# Altium project FIT_PM12_v1.1.PrjPcb (part 6 of 13)

## Sheet FPGA_H.SchDoc: FIT_PM12 board
size 420 x 297 mm; CheckedBy: G.Kasprowicz; Author: INR Moscow; CompanyName: WUT ISE; DrawnBy: M.Podgórski; Organization: WUT ISE; Address1: PW ISE; Address2: Nowowiejska 15/19 00-665 Warsaw; Address3: gkasprow@gmail.com; DocumentNumber: 29; Revision: 2; SheetNumber: 27; SheetTotal: 34; ModifiedBy: -; CheckedDate: -; Title2: FPGA H TDC1; DivGrp: WUT ISE; Designer: INR RAS; ModifiedDate: -; ProjectName: Sensor Box
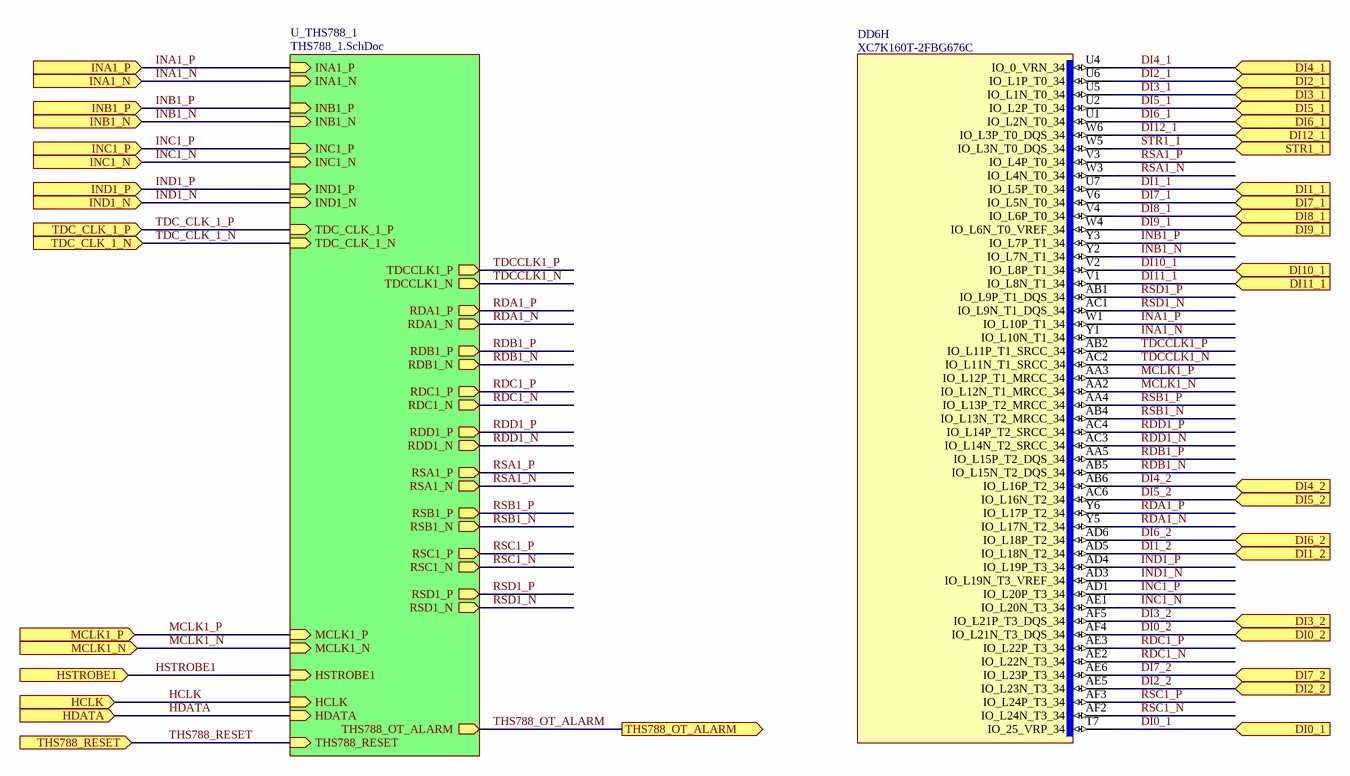
[diagram p15: FPGA_H.SchDoc]

### Parts
DD6  XC7K160T-2FBG676C  [BGA676C100P26X26_2700X2700X254]  (part H of 15)

### Sub-sheets
U_THS788_1 = THS788_1.SchDoc: INC1_P (in), INC1_N (in), IND1_N (in), IND1_P (in), RDD1_P (out), RDD1_N (out), RSD1_P (out), RSD1_N (out), HDATA (in), HCLK (in), HSTROBE1 (in), TDCCLK1_P (out), TDCCLK1_N (out), RSB1_P (out), RSB1_N (out), RDB1_P (out), RDB1_N (out), THS788_OT_ALARM (out), THS788_RESET (in), MCLK1_N (in), MCLK1_P (in), INB1_N (in), INB1_P (in), TDC_CLK_1_P (in), TDC_CLK_1_N (in), INA1_P (in), INA1_N (in), RDA1_N (out), RDA1_P (out), RSA1_P (out), RSA1_N (out), RSC1_N (out), RSC1_P (out), RDC1_N (out), RDC1_P (out)

### Ports
DI0_1 (in), DI0_2 (in), DI1_1 (in), DI1_2 (in), DI2_1 (in), DI2_2 (in), DI3_1 (in), DI3_2 (in), DI4_1 (in), DI4_2 (in), DI5_1 (in), DI5_2 (in), DI6_1 (in), DI6_2 (in), DI7_1 (in), DI7_2 (in), DI8_1 (in), DI9_1 (in), DI10_1 (in), DI11_1 (in), DI12_1 (in), HCLK (in), HDATA (in), HSTROBE1 (in), INA1_N (in), INA1_P (in), INB1_N (in), INB1_P (in), INC1_N (in), INC1_P (in), IND1_N (in), IND1_P (in), MCLK1_N (in), MCLK1_P (in), STR1_1 (in), TDC_CLK_1_N (in), TDC_CLK_1_P (in), THS788_OT_ALARM (out), THS788_RESET (in)

### Nets
DI0_1: DD6.T7(IO_25_VRP_34) ; port DI0_1  [project net DI0_]
DI0_2: DD6.AF4(IO_L21N_T3_DQS_34) ; port DI0_2  [project net DI0_]
DI1_1: DD6.U7(IO_L5P_T0_34) ; port DI1_1  [project net DI1_]
DI1_2: DD6.AD5(IO_L18N_T2_34) ; port DI1_2  [project net DI1_]
DI2_1: DD6.U6(IO_L1P_T0_34) ; port DI2_1  [project net DI2_]
DI2_2: DD6.AE5(IO_L23N_T3_34) ; port DI2_2  [project net DI2_]
DI3_1: DD6.U5(IO_L1N_T0_34) ; port DI3_1  [project net DI3_]
DI3_2: DD6.AF5(IO_L21P_T3_DQS_34) ; port DI3_2  [project net DI3_]
DI4_1: DD6.U4(IO_0_VRN_34) ; port DI4_1  [project net DI4_]
DI4_2: DD6.AB6(IO_L16P_T2_34) ; port DI4_2  [project net DI4_]
DI5_1: DD6.U2(IO_L2P_T0_34) ; port DI5_1  [project net DI5_]
DI5_2: DD6.AC6(IO_L16N_T2_34) ; port DI5_2  [project net DI5_]
DI6_1: DD6.U1(IO_L2N_T0_34) ; port DI6_1  [project net DI6_]
DI6_2: DD6.AD6(IO_L18P_T2_34) ; port DI6_2  [project net DI6_]
DI7_1: DD6.V6(IO_L5N_T0_34) ; port DI7_1  [project net DI7_]
DI7_2: DD6.AE6(IO_L23P_T3_34) ; port DI7_2  [project net DI7_]
DI8_1: DD6.V4(IO_L6P_T0_34) ; port DI8_1  [project net DI8_]
DI9_1: DD6.W4(IO_L6N_T0_VREF_34) ; port DI9_1  [project net DI9_]
DI10_1: DD6.V2(IO_L8P_T1_34) ; port DI10_1  [project net DI10_]
DI11_1: DD6.V1(IO_L8N_T1_34) ; port DI11_1  [project net DI11_]
DI12_1: DD6.W6(IO_L3P_T0_DQS_34) ; port DI12_1  [project net DI12_]
HCLK: port HCLK, sheet U_THS788_1/HCLK
HDATA: port HDATA, sheet U_THS788_1/HDATA
HSTROBE1: port HSTROBE1, sheet U_THS788_1/HSTROBE1
INA1_N: DD6.Y1(IO_L10N_T1_34) ; port INA1_N, sheet U_THS788_1/INA1_N  [project net Event_N]
INA1_P: DD6.W1(IO_L10P_T1_34) ; port INA1_P, sheet U_THS788_1/INA1_P  [project net Event_P]
INB1_N: DD6.Y2(IO_L7N_T1_34) ; port INB1_N, sheet U_THS788_1/INB1_N  [project net Event_N]
INB1_P: DD6.Y3(IO_L7P_T1_34) ; port INB1_P, sheet U_THS788_1/INB1_P  [project net Event_P]
INC1_N: DD6.AE1(IO_L20N_T3_34) ; port INC1_N, sheet U_THS788_1/INC1_N  [project net Event_N]
INC1_P: DD6.AD1(IO_L20P_T3_34) ; port INC1_P, sheet U_THS788_1/INC1_P  [project net Event_P]
IND1_N: DD6.AD3(IO_L19N_T3_VREF_34) ; port IND1_N, sheet U_THS788_1/IND1_N  [project net Event_N]
IND1_P: DD6.AD4(IO_L19P_T3_34) ; port IND1_P, sheet U_THS788_1/IND1_P  [project net Event_P]
MCLK1_N: DD6.AA2(IO_L12N_T1_MRCC_34) ; port MCLK1_N, sheet U_THS788_1/MCLK1_N
MCLK1_P: DD6.AA3(IO_L12P_T1_MRCC_34) ; port MCLK1_P, sheet U_THS788_1/MCLK1_P
RDA1_N: DD6.Y5(IO_L17N_T2_34) ; sheet U_THS788_1/RDA1_N
RDA1_P: DD6.Y6(IO_L17P_T2_34) ; sheet U_THS788_1/RDA1_P
RDB1_N: DD6.AB5(IO_L15N_T2_DQS_34) ; sheet U_THS788_1/RDB1_N
RDB1_P: DD6.AA5(IO_L15P_T2_DQS_34) ; sheet U_THS788_1/RDB1_P
RDC1_N: DD6.AE2(IO_L22N_T3_34) ; sheet U_THS788_1/RDC1_N
RDC1_P: DD6.AE3(IO_L22P_T3_34) ; sheet U_THS788_1/RDC1_P
RDD1_N: DD6.AC3(IO_L14N_T2_SRCC_34) ; sheet U_THS788_1/RDD1_N
RDD1_P: DD6.AC4(IO_L14P_T2_SRCC_34) ; sheet U_THS788_1/RDD1_P
RSA1_N: DD6.W3(IO_L4N_T0_34) ; sheet U_THS788_1/RSA1_N
RSA1_P: DD6.V3(IO_L4P_T0_34) ; sheet U_THS788_1/RSA1_P
RSB1_N: DD6.AB4(IO_L13N_T2_MRCC_34) ; sheet U_THS788_1/RSB1_N
RSB1_P: DD6.AA4(IO_L13P_T2_MRCC_34) ; sheet U_THS788_1/RSB1_P
RSC1_N: DD6.AF2(IO_L24N_T3_34) ; sheet U_THS788_1/RSC1_N
RSC1_P: DD6.AF3(IO_L24P_T3_34) ; sheet U_THS788_1/RSC1_P
RSD1_N: DD6.AC1(IO_L9N_T1_DQS_34) ; sheet U_THS788_1/RSD1_N
RSD1_P: DD6.AB1(IO_L9P_T1_DQS_34) ; sheet U_THS788_1/RSD1_P
STR1_1: DD6.W5(IO_L3N_T0_DQS_34) ; port STR1_1  [project net STR1_]
TDC_CLK_1_N: port TDC_CLK_1_N, sheet U_THS788_1/TDC_CLK_1_N
TDC_CLK_1_P: port TDC_CLK_1_P, sheet U_THS788_1/TDC_CLK_1_P
TDCCLK1_N: DD6.AC2(IO_L11N_T1_SRCC_34) ; sheet U_THS788_1/TDCCLK1_N
TDCCLK1_P: DD6.AB2(IO_L11P_T1_SRCC_34) ; sheet U_THS788_1/TDCCLK1_P
THS788_OT_ALARM: port THS788_OT_ALARM, sheet U_THS788_1/THS788_OT_ALARM
THS788_RESET: port THS788_RESET, sheet U_THS788_1/THS788_RESET

### Notes on the sheet
- Project/Equipment
- Document
- Designer
- Drawn by
- Check.by
- Copyright WUT ISE 2024.
  This documentation describes Open Hardware and is licensed under the CERN OHL v.2. You may redistribute and modify this documentation under the terms of the CERN OHL v.2. (http://ohwr.org/CERNOHL). This documentation is distributed WITHOUT ANY EXPRESS OR IMPLIED WARRANTY, INCLUDING OF MERCHANTABILITY, SATISFACTORY QUALITY AND FITNESS FOR A PARTICULAR PURPOSE. Please see the CERN OHL v.2 for applicable conditions.
- Contact
- File
- Last Mod.
- Print Date
- Sheet
- Size
- A3
- of
- Rev

### Library data of the parts
DD6 = XC7K160T-2FBG676C: KINTEX-7, FPGA, 676-Ball BGA, Pb-Free; Part Description: KINTEX-7 FPGA, 162240 Logic Cells, 400 User I/O, 8 GTXs, 676-Ball BGA, Speed Grade 2, Commercial Grade, Pb-Free; Manufacturer: XILINX; PressFit: No; Bonding: No; Part Number: XC7K160T-2FBG676C; Component Kind: Standard; Component Type: Standard; Device: XC7K160T-2FBG676C; PackageDescription: BGA, 1.00mm Pitch, Square; 676 Pin, 26 Columns X 26 Rows, Body 27.0mm X 27.0mm X 2.54mm H, IPC Medium Density; Manufacturer Part Number: XC7K160T-2FBG676C; Pin Count: 676; Case: BGA676; Mounted: Yes; Socket: No; SMD: Yes; Sense: No; ComponentHeight: 2.54mm; HelpURL: \\cern.ch\dfs\Applications\Altium\Datasheets\XC7K160T-xFBG676C.pdf; ComponentLink1URL: \\cern.ch\dfs\Applications\Altium\Datasheets\XC7K160T-xFBG676C_Package-Pinout.pdf; ComponentLink1Description: Package/Pinout; Author: CERN DEM BC; CreateDate: 06.02.2020; LatestRevisionDate: 06.02.2020

## Sheet THS788_1.SchDoc: FIT_PM12 board
size 420 x 297 mm; CheckedBy: G.Kasprowicz; Author: INR Moscow; CompanyName: WUT ISE; DrawnBy: M.Podgórski; Organization: WUT ISE; Address1: PW ISE; Address2: Nowowiejska 15/19 00-665 Warsaw; Address3: gkasprow@gmail.com; DocumentNumber: 22; Revision: 2; SheetNumber: 28; SheetTotal: 34; ModifiedBy: -; CheckedDate: -; Title2: TDC1; DivGrp: WUT ISE; Designer: INR RAS; ModifiedDate: -; ProjectName: Sensor Box
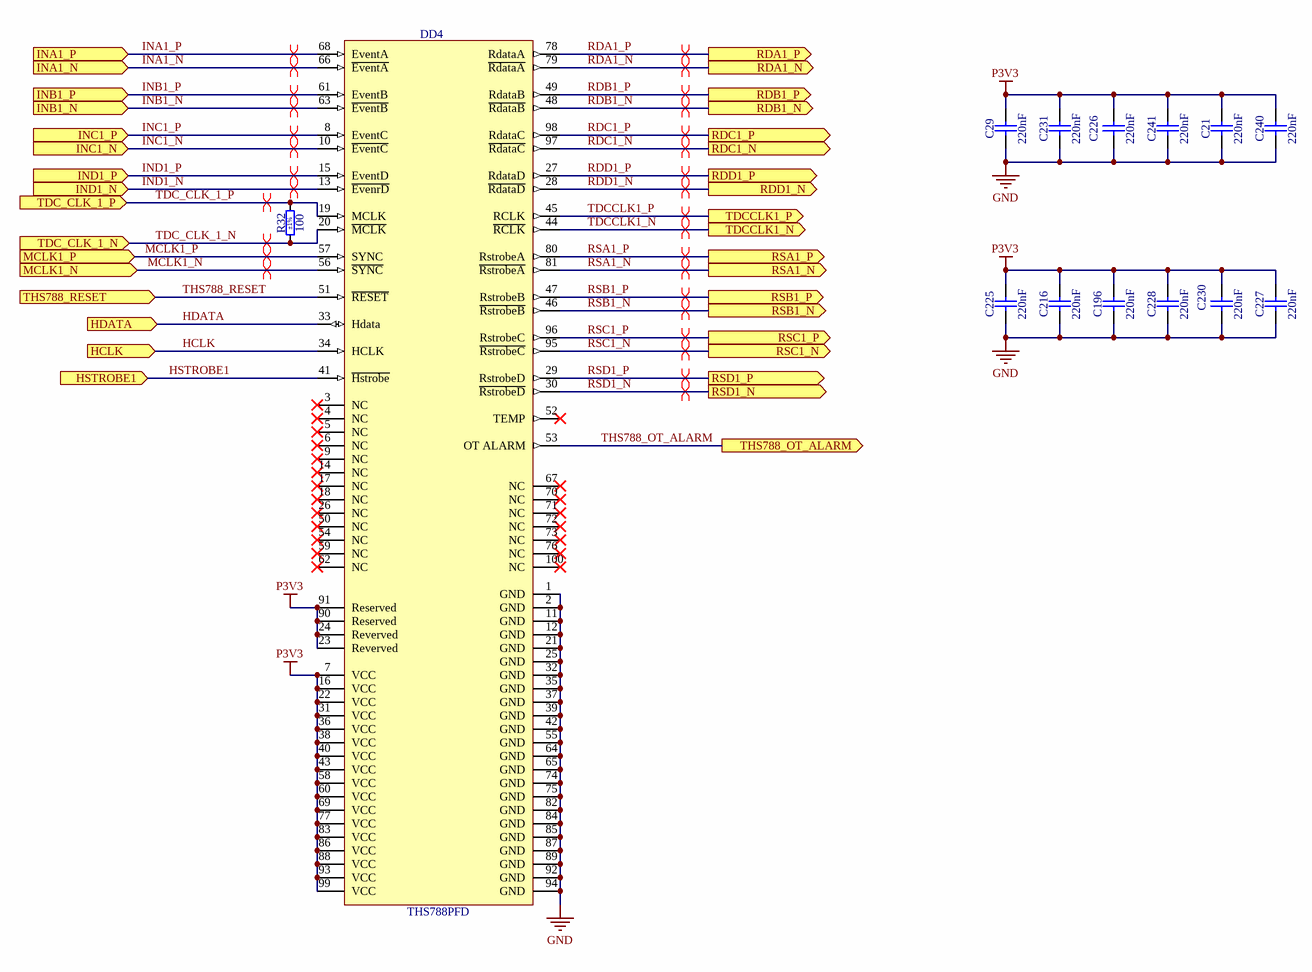
[diagram p16: THS788_1.SchDoc]

### Parts
C21  220nF  [CAPC2012X135N]
C29  220nF  [CAPC2012X135N]
C196  220nF  [CAPC2012X135N]
C216  220nF  [CAPC2012X135N]
C225  220nF  [CAPC2012X135N]
C226  220nF  [CAPC2012X135N]
C227  220nF  [CAPC2012X135N]
C228  220nF  [CAPC2012X135N]
C230  220nF  [CAPC2012X135N]
C231  220nF  [CAPC2012X135N]
C240  220nF  [CAPC2012X135N]
C241  220nF  [CAPC2012X135N]
DD4  THS788PFD  [TEXAS_PFD (S-PQFP-G100)]
R32  100  Tolerance: ±1%  [RESC1608X55N]

### Ports
HCLK (in), HDATA (in), HSTROBE1 (in), INA1_N (in), INA1_P (in), INB1_N (in), INB1_P (in), INC1_N (in), INC1_P (in), IND1_N (in), IND1_P (in), MCLK1_N (in), MCLK1_P (in), RDA1_N (out), RDA1_P (out), RDB1_N (out), RDB1_P (out), RDC1_N (out), RDC1_P (out), RDD1_N (out), RDD1_P (out), RSA1_N (out), RSA1_P (out), RSB1_N (out), RSB1_P (out), RSC1_N (out), RSC1_P (out), RSD1_N (out), RSD1_P (out), TDC_CLK_1_N (in), TDC_CLK_1_P (in), TDCCLK1_N (out), TDCCLK1_P (out), THS788_OT_ALARM (out), THS788_RESET (in)

### Nets
GND: C21.1 C29.1 C196.1 C216.1 C225.1 C226.1 C227.1 C228.1 C230.1 C231.1 C240.1 C241.1 DD4.1(GND) DD4.2(GND) DD4.11(GND) DD4.12(GND) DD4.21(GND) DD4.25(GND) DD4.32(GND) DD4.35(GND) DD4.37(GND) DD4.39(GND) DD4.42(GND) DD4.55(GND) DD4.64(GND) DD4.65(GND) DD4.74(GND) DD4.75(GND) DD4.82(GND) DD4.84(GND) DD4.85(GND) DD4.87(GND) DD4.89(GND) DD4.92(GND) DD4.94(GND)
P3V3: C21.2 C29.2 C196.2 C216.2 C225.2 C226.2 C227.2 C228.2 C230.2 C231.2 C240.2 C241.2 DD4.7(VCC) DD4.16(VCC) DD4.22(VCC) DD4.23(Reverved) DD4.24(Reverved) DD4.31(VCC) DD4.36(VCC) DD4.38(VCC) DD4.40(VCC) DD4.43(VCC) DD4.58(VCC) DD4.60(VCC) DD4.69(VCC) DD4.77(VCC) DD4.83(VCC) DD4.86(VCC) DD4.88(VCC) DD4.90(Reserved) DD4.91(Reserved) DD4.93(VCC) DD4.99(VCC)
HCLK: DD4.34(HCLK) ; port HCLK
HDATA: DD4.33(Hdata) ; port HDATA
HSTROBE1: DD4.41(~{Hstrobe}) ; port HSTROBE1
INA1_N: DD4.66(~{EventA}) ; port INA1_N  [project net Event_N]
INA1_P: DD4.68(EventA) ; port INA1_P  [project net Event_P]
INB1_N: DD4.63(~{EventB}) ; port INB1_N  [project net Event_N]
INB1_P: DD4.61(EventB) ; port INB1_P  [project net Event_P]
INC1_N: DD4.10(~{EventC}) ; port INC1_N  [project net Event_N]
INC1_P: DD4.8(EventC) ; port INC1_P  [project net Event_P]
IND1_N: DD4.13(~{EvenrD}) ; port IND1_N  [project net Event_N]
IND1_P: DD4.15(EventD) ; port IND1_P  [project net Event_P]
MCLK1_N: DD4.56(~{SYNC}) ; port MCLK1_N
MCLK1_P: DD4.57(SYNC) ; port MCLK1_P
RDA1_N: DD4.79(~{RdataA}) ; port RDA1_N
RDA1_P: DD4.78(RdataA) ; port RDA1_P
RDB1_N: DD4.48(~{RdataB}) ; port RDB1_N
RDB1_P: DD4.49(RdataB) ; port RDB1_P
RDC1_N: DD4.97(~{RdataC}) ; port RDC1_N
RDC1_P: DD4.98(RdataC) ; port RDC1_P
RDD1_N: DD4.28(~{RdataD}) ; port RDD1_N
RDD1_P: DD4.27(RdataD) ; port RDD1_P
RSA1_N: DD4.81(~{RstrobeA}) ; port RSA1_N
RSA1_P: DD4.80(RstrobeA) ; port RSA1_P
RSB1_N: DD4.46(~{RstrobeB}) ; port RSB1_N
RSB1_P: DD4.47(RstrobeB) ; port RSB1_P
RSC1_N: DD4.95(~{RstrobeC}) ; port RSC1_N
RSC1_P: DD4.96(RstrobeC) ; port RSC1_P
RSD1_N: DD4.30(~{RstrobeD}) ; port RSD1_N
RSD1_P: DD4.29(RstrobeD) ; port RSD1_P
TDC_CLK_1_N: DD4.20(~{MCLK}) R32.1 ; port TDC_CLK_1_N
TDC_CLK_1_P: DD4.19(MCLK) R32.2 ; port TDC_CLK_1_P
TDCCLK1_N: DD4.44(~{RCLK}) ; port TDCCLK1_N
TDCCLK1_P: DD4.45(RCLK) ; port TDCCLK1_P
THS788_OT_ALARM: DD4.53(OT_ALARM) ; port THS788_OT_ALARM
THS788_RESET: DD4.51(~{RESET}) ; port THS788_RESET

Not connected (* = marked no-connect by the designer): DD4 3(NC)* 4(NC)* 5(NC)* 6(NC)* 9(NC)* 14(NC)* 17(NC)* 18(NC)* 26(NC)* 50(NC)* 52(TEMP)* 54(NC)* 59(NC)* 62(NC)* 67(NC)* 70(NC)* 71(NC)* 72(NC)* 73(NC)* 76(NC)* 100(NC)*

### Layout directives
differential pair: Event_N, Event_P, MCLK1_N, MCLK1_P, RDA1_N, RDA1_P, RDB1_N, RDB1_P, RDC1_N, RDC1_P, RDD1_N, RDD1_P, RSA1_N, RSA1_P, RSB1_N, RSB1_P, RSC1_N, RSC1_P, RSD1_N, RSD1_P, TDC_CLK_1_N, TDC_CLK_1_P, TDCCLK1_N, TDCCLK1_P

### Notes on the sheet
- Project/Equipment
- Document
- Designer
- Drawn by
- Check.by
- Copyright WUT ISE 2024.
  This documentation describes Open Hardware and is licensed under the CERN OHL v.2. You may redistribute and modify this documentation under the terms of the CERN OHL v.2. (http://ohwr.org/CERNOHL). This documentation is distributed WITHOUT ANY EXPRESS OR IMPLIED WARRANTY, INCLUDING OF MERCHANTABILITY, SATISFACTORY QUALITY AND FITNESS FOR A PARTICULAR PURPOSE. Please see the CERN OHL v.2 for applicable conditions.
- Contact
- File
- Last Mod.
- Print Date
- Sheet
- Size
- A3
- of
- Rev

### Library data of the parts
C21 C29 C196 C216 C225-C228 C230 C231 C240 C241 = CC0805_220NF_50V_10%_X7R: Non-polarised capacitor; Part Description: SMD Multilayer Chip Ceramic Capacitor; Manufacturer: GENERIC; Manufacturer1 Part Number: GRM21BR71H224KA01L; Voltage: 50V; TC: X7R; Tolerance: ±10%; Part Number: CC0805_220NF_50V_10%_X7R; Component Kind: Standard; Component Type: Standard; Pin Count: 2; Value: 220nF; Status: Preferred; Manufacturer Part Number: CC0805_220NF_50V_10%_X7R; Case: 0805; Mounted: Yes; Socket: No; SMD: Yes; Sense: No; Manufacturer1 Example: MURATA; Manufacturer1 ComponentHeight: 1.35mm; HelpURL: \\cern.ch\dfs\Applications\Altium\Datasheets\CC0805_X7R_MURATA.pdf; Author: CERN DEM JLC; CreateDate: 03.12.2007; LatestRevisionDate: 03.12.2007
DD4 = THS788PFD: Quad-Channel Time Measurement Unit (TMU); Manufacturer: TEXAS INSTRUMENTS; PressFit: No; Bonding: No; Part Number: THS788PFD; Component Kind: Standard; Component Type: Standard; Device: THS788PFD; Footprint: TEXAS_1PFD (S-PQFP-G100); PackageDescription: QFP, 0.50mm Pitch, Square; 100 Pin, 14.0mm L X 14.0mm W X 1.20mm H body (w/Thermal Tab 6.0 X 6.0mm), IPC Medium Density; Status: Not Recommended; Part Description: Quad-Channel Time Measurement Unit (TMU); Manufacturer Part Number: THS788PFD; Pin Count: 101; Case: QFP100; Mounted: Yes; Socket: No; SMD: Yes; Sense: No; ComponentHeight: 1.2mm; Author: CERN DEM HF; HelpURL: \\cern.ch\dfs\Applications\Altium\Datasheets\THS788.pdf; CreateDate: 10.06.2024; LatestRevisionDate: 10.06.2024
R32 = R0603_100R_1%_0.1W_100PPM: Resistor - 1%; Part Description: General Purpose Thick Film Chip Resistor; Manufacturer: GENERIC; Manufacturer1 Part Number: NRC06F4700TRF; Power: 0.1W; TC: ±100ppm/°C; PressFit: No; Part Number: R0603_100R_1%_0.1W_100PPM; Component Kind: Standard; Component Type: Standard; Pin Count: 2; Value: 100; Status: Preferred; Manufacturer Part Number: R0603_100R_1%_0.1W_100PPM; Case: 0603; Mounted: Yes; Sense: No; Socket: No; SMD: Yes; Manufacturer1 Example: NIC COMPONENT; Manufacturer1 ComponentHeight: 0.55mm; HelpURL: \\cern.ch\dfs\Applications\Altium\Datasheets\R0603_1NIC_1NRC.pdf; Author: CERN DEM JLC; CreateDate: 03.12.2007; LatestRevisionDate: 13.03.2008

## Sheet FPGA_D_F.SchDoc: FIT_PM12 board
size 420 x 297 mm; CheckedBy: G.Kasprowicz; Author: INR Moscow; CompanyName: WUT ISE; DrawnBy: M.Podgórski; Organization: WUT ISE; Address1: PW ISE; Address2: Nowowiejska 15/19 00-665 Warsaw; Address3: gkasprow@gmail.com; DocumentNumber: 31; Revision: 2; SheetNumber: 30; SheetTotal: 34; ModifiedBy: -; CheckedDate: -; Title2: FPGA D F TDC3; DivGrp: WUT ISE; Designer: INR RAS; ModifiedDate: -; ProjectName: Sensor Box
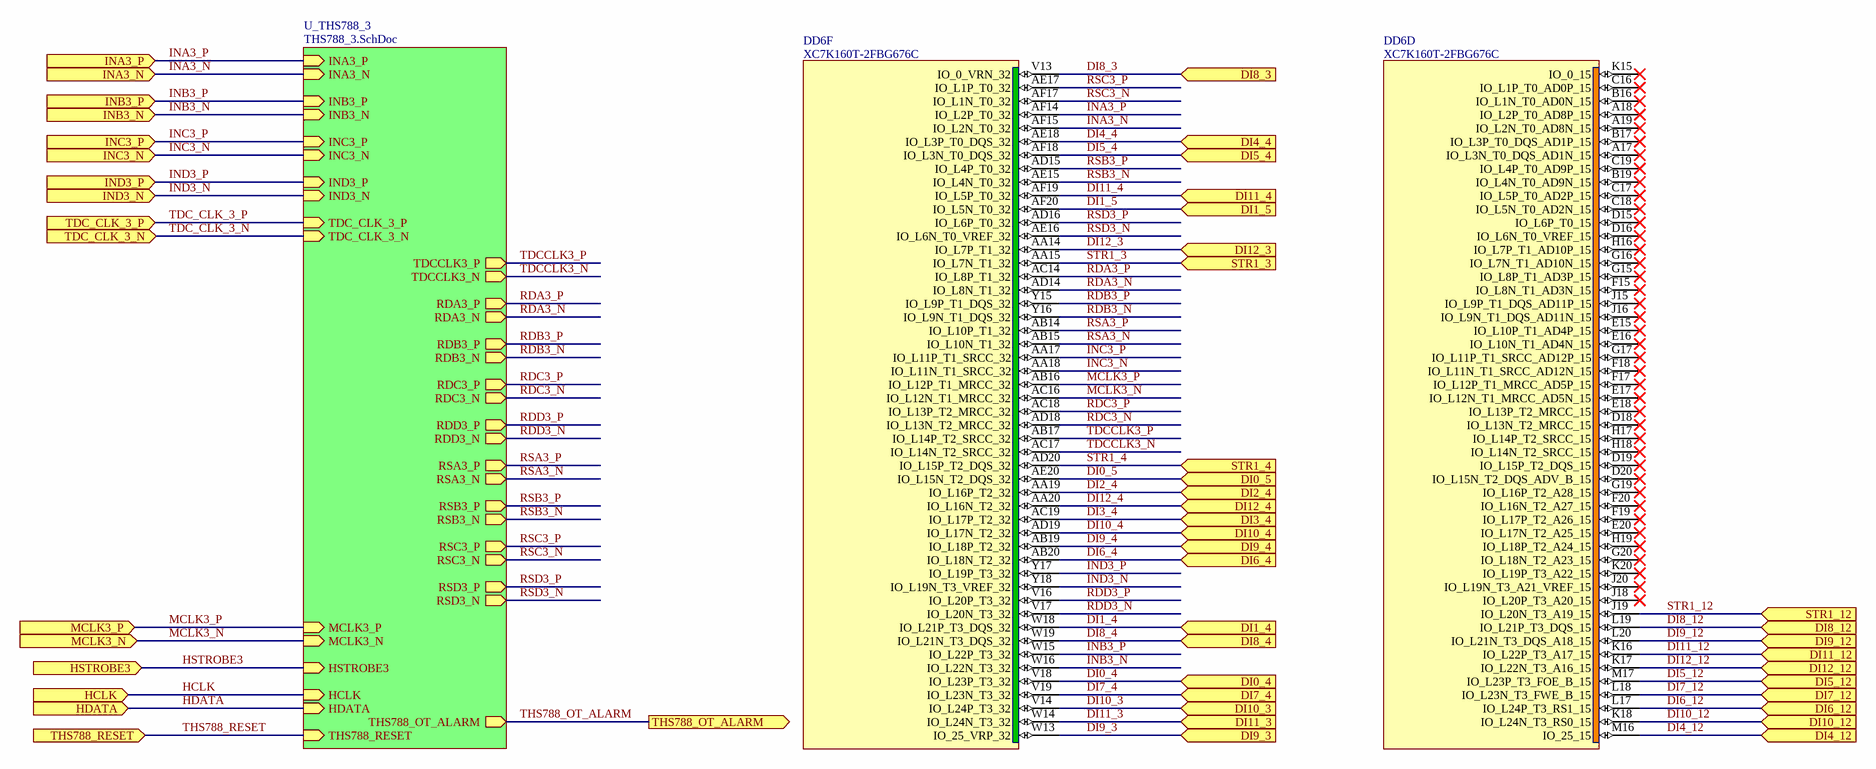
[diagram p17: FPGA_D_F.SchDoc]

### Parts
DD6  XC7K160T-2FBG676C  [BGA676C100P26X26_2700X2700X254]  (parts D,F of 15)

### Sub-sheets
U_THS788_3 = THS788_3.SchDoc: INC3_P (in), INC3_N (in), IND3_N (in), IND3_P (in), RDD3_P (out), RDD3_N (out), RSD3_P (out), RSD3_N (out), HDATA (in), HCLK (in), HSTROBE3 (in), TDCCLK3_P (out), TDCCLK3_N (out), RSB3_P (out), RSB3_N (out), RDB3_P (out), RDB3_N (out), THS788_OT_ALARM (out), THS788_RESET (in), MCLK3_N (in), MCLK3_P (in), INB3_N (in), INB3_P (in), TDC_CLK_3_P (in), TDC_CLK_3_N (in), INA3_P (in), INA3_N (in), RDA3_N (out), RDA3_P (out), RSA3_P (out), RSA3_N (out), RSC3_N (out), RSC3_P (out), RDC3_N (out), RDC3_P (out)

### Ports
DI0_4 (in), DI0_5 (in), DI1_4 (in), DI1_5 (in), DI2_4 (in), DI3_4 (in), DI4_4 (in), DI4_12 (in), DI5_4 (in), DI5_12 (in), DI6_4 (in), DI6_12 (in), DI7_4 (in), DI7_12 (in), DI8_3 (in), DI8_4 (in), DI8_12 (in), DI9_3 (in), DI9_4 (in), DI9_12 (in), DI10_3 (in), DI10_4 (in), DI10_12 (in), DI11_3 (in), DI11_4 (in), DI11_12 (in), DI12_3 (in), DI12_4 (in), DI12_12 (in), HCLK (in), HDATA (in), HSTROBE3 (in), INA3_N (in), INA3_P (in), INB3_N (in), INB3_P (in), INC3_N (in), INC3_P (in), IND3_N (in), IND3_P (in), MCLK3_N (in), MCLK3_P (in), STR1_3 (in), STR1_4 (in), STR1_12 (in), TDC_CLK_3_N (in), TDC_CLK_3_P (in), THS788_OT_ALARM (out), THS788_RESET (in)

### Nets
DI0_4: DD6.V18(IO_L23P_T3_32) ; port DI0_4  [project net DI0_]
DI0_5: DD6.AE20(IO_L15N_T2_DQS_32) ; port DI0_5  [project net DI0_]
DI1_4: DD6.W18(IO_L21P_T3_DQS_32) ; port DI1_4  [project net DI1_]
DI1_5: DD6.AF20(IO_L5N_T0_32) ; port DI1_5  [project net DI1_]
DI2_4: DD6.AA19(IO_L16P_T2_32) ; port DI2_4  [project net DI2_]
DI3_4: DD6.AC19(IO_L17P_T2_32) ; port DI3_4  [project net DI3_]
DI4_4: DD6.AE18(IO_L3P_T0_DQS_32) ; port DI4_4  [project net DI4_]
DI4_12: DD6.M16(IO_25_15) ; port DI4_12  [project net DI4_]
DI5_4: DD6.AF18(IO_L3N_T0_DQS_32) ; port DI5_4  [project net DI5_]
DI5_12: DD6.M17(IO_L23P_T3_FOE_B_15) ; port DI5_12  [project net DI5_]
DI6_4: DD6.AB20(IO_L18N_T2_32) ; port DI6_4  [project net DI6_]
DI6_12: DD6.L17(IO_L24P_T3_RS1_15) ; port DI6_12  [project net DI6_]
DI7_4: DD6.V19(IO_L23N_T3_32) ; port DI7_4  [project net DI7_]
DI7_12: DD6.L18(IO_L23N_T3_FWE_B_15) ; port DI7_12  [project net DI7_]
DI8_3: DD6.V13(IO_0_VRN_32) ; port DI8_3  [project net DI8_]
DI8_4: DD6.W19(IO_L21N_T3_DQS_32) ; port DI8_4  [project net DI8_]
DI8_12: DD6.L19(IO_L21P_T3_DQS_15) ; port DI8_12  [project net DI8_]
DI9_3: DD6.W13(IO_25_VRP_32) ; port DI9_3  [project net DI9_]
DI9_4: DD6.AB19(IO_L18P_T2_32) ; port DI9_4  [project net DI9_]
DI9_12: DD6.L20(IO_L21N_T3_DQS_A18_15) ; port DI9_12  [project net DI9_]
DI10_3: DD6.V14(IO_L24P_T3_32) ; port DI10_3  [project net DI10_]
DI10_4: DD6.AD19(IO_L17N_T2_32) ; port DI10_4  [project net DI10_]
DI10_12: DD6.K18(IO_L24N_T3_RS0_15) ; port DI10_12  [project net DI10_]
DI11_3: DD6.W14(IO_L24N_T3_32) ; port DI11_3  [project net DI11_]
DI11_4: DD6.AF19(IO_L5P_T0_32) ; port DI11_4  [project net DI11_]
DI11_12: DD6.K16(IO_L22P_T3_A17_15) ; port DI11_12  [project net DI11_]
DI12_3: DD6.AA14(IO_L7P_T1_32) ; port DI12_3  [project net DI12_]
DI12_4: DD6.AA20(IO_L16N_T2_32) ; port DI12_4  [project net DI12_]
DI12_12: DD6.K17(IO_L22N_T3_A16_15) ; port DI12_12  [project net DI12_]
HCLK: port HCLK, sheet U_THS788_3/HCLK
HDATA: port HDATA, sheet U_THS788_3/HDATA
HSTROBE3: port HSTROBE3, sheet U_THS788_3/HSTROBE3
INA3_N: DD6.AF15(IO_L2N_T0_32) ; port INA3_N, sheet U_THS788_3/INA3_N  [project net Event_N]
INA3_P: DD6.AF14(IO_L2P_T0_32) ; port INA3_P, sheet U_THS788_3/INA3_P  [project net Event_P]
INB3_N: DD6.W16(IO_L22N_T3_32) ; port INB3_N, sheet U_THS788_3/INB3_N  [project net Event_N]
INB3_P: DD6.W15(IO_L22P_T3_32) ; port INB3_P, sheet U_THS788_3/INB3_P  [project net Event_P]
INC3_N: DD6.AA18(IO_L11N_T1_SRCC_32) ; port INC3_N, sheet U_THS788_3/INC3_N  [project net Event_N]
INC3_P: DD6.AA17(IO_L11P_T1_SRCC_32) ; port INC3_P, sheet U_THS788_3/INC3_P  [project net Event_P]
IND3_N: DD6.Y18(IO_L19N_T3_VREF_32) ; port IND3_N, sheet U_THS788_3/IND3_N  [project net Event_N]
IND3_P: DD6.Y17(IO_L19P_T3_32) ; port IND3_P, sheet U_THS788_3/IND3_P  [project net Event_P]
MCLK3_N: DD6.AC16(IO_L12N_T1_MRCC_32) ; port MCLK3_N, sheet U_THS788_3/MCLK3_N
MCLK3_P: DD6.AB16(IO_L12P_T1_MRCC_32) ; port MCLK3_P, sheet U_THS788_3/MCLK3_P
RDA3_N: DD6.AD14(IO_L8N_T1_32) ; sheet U_THS788_3/RDA3_N
RDA3_P: DD6.AC14(IO_L8P_T1_32) ; sheet U_THS788_3/RDA3_P
RDB3_N: DD6.Y16(IO_L9N_T1_DQS_32) ; sheet U_THS788_3/RDB3_N
RDB3_P: DD6.Y15(IO_L9P_T1_DQS_32) ; sheet U_THS788_3/RDB3_P
RDC3_N: DD6.AD18(IO_L13N_T2_MRCC_32) ; sheet U_THS788_3/RDC3_N
RDC3_P: DD6.AC18(IO_L13P_T2_MRCC_32) ; sheet U_THS788_3/RDC3_P
RDD3_N: DD6.V17(IO_L20N_T3_32) ; sheet U_THS788_3/RDD3_N
RDD3_P: DD6.V16(IO_L20P_T3_32) ; sheet U_THS788_3/RDD3_P
RSA3_N: DD6.AB15(IO_L10N_T1_32) ; sheet U_THS788_3/RSA3_N
RSA3_P: DD6.AB14(IO_L10P_T1_32) ; sheet U_THS788_3/RSA3_P
RSB3_N: DD6.AE15(IO_L4N_T0_32) ; sheet U_THS788_3/RSB3_N
RSB3_P: DD6.AD15(IO_L4P_T0_32) ; sheet U_THS788_3/RSB3_P
RSC3_N: DD6.AF17(IO_L1N_T0_32) ; sheet U_THS788_3/RSC3_N
RSC3_P: DD6.AE17(IO_L1P_T0_32) ; sheet U_THS788_3/RSC3_P
RSD3_N: DD6.AE16(IO_L6N_T0_VREF_32) ; sheet U_THS788_3/RSD3_N
RSD3_P: DD6.AD16(IO_L6P_T0_32) ; sheet U_THS788_3/RSD3_P
STR1_3: DD6.AA15(IO_L7N_T1_32) ; port STR1_3  [project net STR1_]
STR1_4: DD6.AD20(IO_L15P_T2_DQS_32) ; port STR1_4  [project net STR1_]
STR1_12: DD6.J19(IO_L20N_T3_A19_15) ; port STR1_12  [project net STR1_]
TDC_CLK_3_N: port TDC_CLK_3_N, sheet U_THS788_3/TDC_CLK_3_N
TDC_CLK_3_P: port TDC_CLK_3_P, sheet U_THS788_3/TDC_CLK_3_P
TDCCLK3_N: DD6.AC17(IO_L14N_T2_SRCC_32) ; sheet U_THS788_3/TDCCLK3_N
TDCCLK3_P: DD6.AB17(IO_L14P_T2_SRCC_32) ; sheet U_THS788_3/TDCCLK3_P
THS788_OT_ALARM: port THS788_OT_ALARM, sheet U_THS788_3/THS788_OT_ALARM
THS788_RESET: port THS788_RESET, sheet U_THS788_3/THS788_RESET

Not connected (* = marked no-connect by the designer): DD6 A17(IO_L3N_T0_DQS_AD1N_15)* A18(IO_L2P_T0_AD8P_15)* A19(IO_L2N_T0_AD8N_15)* B16(IO_L1N_T0_AD0N_15)* B17(IO_L3P_T0_DQS_AD1P_15)* B19(IO_L4N_T0_AD9N_15)* C16(IO_L1P_T0_AD0P_15)* C17(IO_L5P_T0_AD2P_15)* C18(IO_L5N_T0_AD2N_15)* C19(IO_L4P_T0_AD9P_15)* D15(IO_L6P_T0_15)* D16(IO_L6N_T0_VREF_15)* D18(IO_L13N_T2_MRCC_15)* D19(IO_L15P_T2_DQS_15)* D20(IO_L15N_T2_DQS_ADV_B_15)* E15(IO_L10P_T1_AD4P_15)* E16(IO_L10N_T1_AD4N_15)* E17(IO_L12N_T1_MRCC_AD5N_15)* E18(IO_L13P_T2_MRCC_15)* E20(IO_L17N_T2_A25_15)* F15(IO_L8N_T1_AD3N_15)* F17(IO_L12P_T1_MRCC_AD5P_15)* F18(IO_L11N_T1_SRCC_AD12N_15)* F19(IO_L17P_T2_A26_15)* F20(IO_L16N_T2_A27_15)* G15(IO_L8P_T1_AD3P_15)* G16(IO_L7N_T1_AD10N_15)* G17(IO_L11P_T1_SRCC_AD12P_15)* G19(IO_L16P_T2_A28_15)* G20(IO_L18N_T2_A23_15)* H16(IO_L7P_T1_AD10P_15)* H17(IO_L14P_T2_SRCC_15)* H18(IO_L14N_T2_SRCC_15)* H19(IO_L18P_T2_A24_15)* J15(IO_L9P_T1_DQS_AD11P_15)* J16(IO_L9N_T1_DQS_AD11N_15)* J18(IO_L20P_T3_A20_15)* J20(IO_L19N_T3_A21_VREF_15)* K15(IO_0_15)* K20(IO_L19P_T3_A22_15)*

### Notes on the sheet
- Project/Equipment
- Document
- Designer
- Drawn by
- Check.by
- Copyright WUT ISE 2024.
  This documentation describes Open Hardware and is licensed under the CERN OHL v.2. You may redistribute and modify this documentation under the terms of the CERN OHL v.2. (http://ohwr.org/CERNOHL). This documentation is distributed WITHOUT ANY EXPRESS OR IMPLIED WARRANTY, INCLUDING OF MERCHANTABILITY, SATISFACTORY QUALITY AND FITNESS FOR A PARTICULAR PURPOSE. Please see the CERN OHL v.2 for applicable conditions.
- Contact
- File
- Last Mod.
- Print Date
- Sheet
- Size
- A3
- of
- Rev

### Library data of the parts
DD6 = XC7K160T-2FBG676C: as DD6 on sheet FPGA_H; Part Number: XC7K160T-2FBG676C; Component Kind: Standard; Component Type: Standard; Device: XC7K160T-2FBG676C; PackageDescription: BGA, 1.00mm Pitch, Square; 676 Pin, 26 Columns X 26 Rows, Body 27.0mm X 27.0mm X 2.54mm H, IPC Medium Density; Manufacturer Part Number: XC7K160T-2FBG676C; Pin Count: 676; Case: BGA676; Mounted: Yes; Socket: No; SMD: Yes; Sense: No; ComponentHeight: 2.54mm; HelpURL: \\cern.ch\dfs\Applications\Altium\Datasheets\XC7K160T-xFBG676C.pdf; ComponentLink1URL: \\cern.ch\dfs\Applications\Altium\Datasheets\XC7K160T-xFBG676C_Package-Pinout.pdf; ComponentLink1Description: Package/Pinout; Author: CERN DEM BC; CreateDate: 06.02.2020; LatestRevisionDate: 06.02.2020

## Sheet THS788_3.SchDoc: FIT_PM12 board
size 420 x 297 mm; CheckedBy: G.Kasprowicz; Author: INR Moscow; CompanyName: WUT ISE; DrawnBy: M.Podgórski; Organization: WUT ISE; Address1: PW ISE; Address2: Nowowiejska 15/19 00-665 Warsaw; Address3: gkasprow@gmail.com; DocumentNumber: 24; Revision: 2; SheetNumber: 31; SheetTotal: 34; ModifiedBy: -; CheckedDate: -; Title2: TDC3; DivGrp: WUT ISE; Designer: INR RAS; ModifiedDate: -; ProjectName: Sensor Box
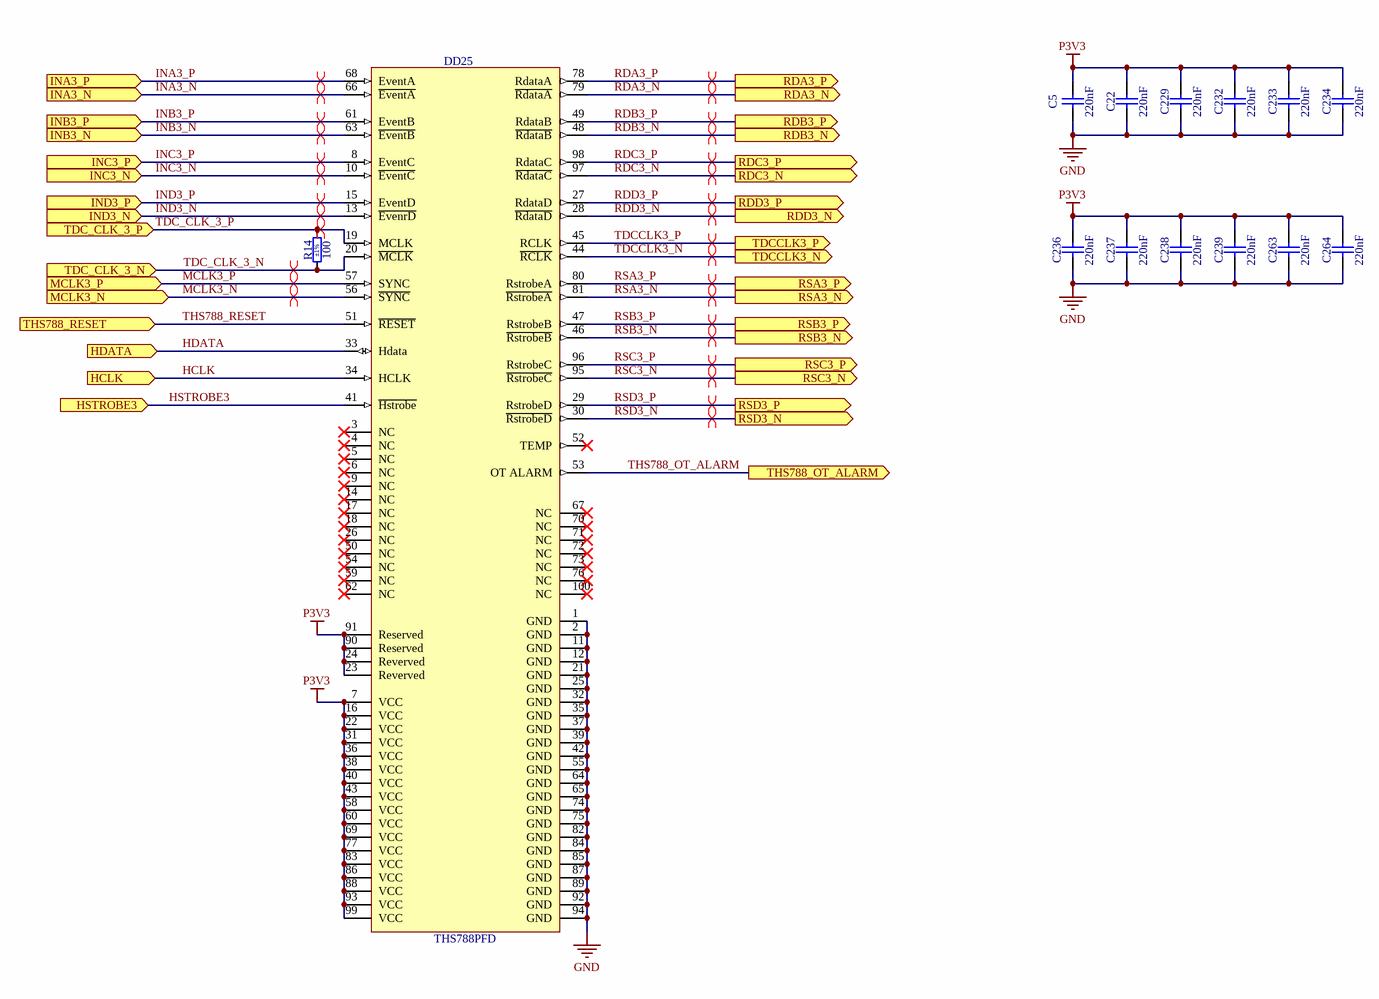
[diagram p18: THS788_3.SchDoc]

### Parts
C5  220nF  [CAPC2012X135N]
C22  220nF  [CAPC2012X135N]
C229  220nF  [CAPC2012X135N]
C232  220nF  [CAPC2012X135N]
C233  220nF  [CAPC2012X135N]
C234  220nF  [CAPC2012X135N]
C236  220nF  [CAPC2012X135N]
C237  220nF  [CAPC2012X135N]
C238  220nF  [CAPC2012X135N]
C239  220nF  [CAPC2012X135N]
C263  220nF  [CAPC2012X135N]
C264  220nF  [CAPC2012X135N]
DD25  THS788PFD  [TEXAS_PFD (S-PQFP-G100)]
R14  100  Tolerance: ±1%  [RESC1608X55N]

### Ports
HCLK (in), HDATA (in), HSTROBE3 (in), INA3_N (in), INA3_P (in), INB3_N (in), INB3_P (in), INC3_N (in), INC3_P (in), IND3_N (in), IND3_P (in), MCLK3_N (in), MCLK3_P (in), RDA3_N (out), RDA3_P (out), RDB3_N (out), RDB3_P (out), RDC3_N (out), RDC3_P (out), RDD3_N (out), RDD3_P (out), RSA3_N (out), RSA3_P (out), RSB3_N (out), RSB3_P (out), RSC3_N (out), RSC3_P (out), RSD3_N (out), RSD3_P (out), TDC_CLK_3_N (in), TDC_CLK_3_P (in), TDCCLK3_N (out), TDCCLK3_P (out), THS788_OT_ALARM (out), THS788_RESET (in)

### Nets
GND: C5.1 C22.1 C229.1 C232.1 C233.1 C234.1 C236.1 C237.1 C238.1 C239.1 C263.1 C264.1 DD25.1(GND) DD25.2(GND) DD25.11(GND) DD25.12(GND) DD25.21(GND) DD25.25(GND) DD25.32(GND) DD25.35(GND) DD25.37(GND) DD25.39(GND) DD25.42(GND) DD25.55(GND) DD25.64(GND) DD25.65(GND) DD25.74(GND) DD25.75(GND) DD25.82(GND) DD25.84(GND) DD25.85(GND) DD25.87(GND) DD25.89(GND) DD25.92(GND) DD25.94(GND)
P3V3: C5.2 C22.2 C229.2 C232.2 C233.2 C234.2 C236.2 C237.2 C238.2 C239.2 C263.2 C264.2 DD25.7(VCC) DD25.16(VCC) DD25.22(VCC) DD25.23(Reverved) DD25.24(Reverved) DD25.31(VCC) DD25.36(VCC) DD25.38(VCC) DD25.40(VCC) DD25.43(VCC) DD25.58(VCC) DD25.60(VCC) DD25.69(VCC) DD25.77(VCC) DD25.83(VCC) DD25.86(VCC) DD25.88(VCC) DD25.90(Reserved) DD25.91(Reserved) DD25.93(VCC) DD25.99(VCC)
HCLK: DD25.34(HCLK) ; port HCLK
HDATA: DD25.33(Hdata) ; port HDATA
HSTROBE3: DD25.41(~{Hstrobe}) ; port HSTROBE3
INA3_N: DD25.66(~{EventA}) ; port INA3_N  [project net Event_N]
INA3_P: DD25.68(EventA) ; port INA3_P  [project net Event_P]
INB3_N: DD25.63(~{EventB}) ; port INB3_N  [project net Event_N]
INB3_P: DD25.61(EventB) ; port INB3_P  [project net Event_P]
INC3_N: DD25.10(~{EventC}) ; port INC3_N  [project net Event_N]
INC3_P: DD25.8(EventC) ; port INC3_P  [project net Event_P]
IND3_N: DD25.13(~{EvenrD}) ; port IND3_N  [project net Event_N]
IND3_P: DD25.15(EventD) ; port IND3_P  [project net Event_P]
MCLK3_N: DD25.56(~{SYNC}) ; port MCLK3_N
MCLK3_P: DD25.57(SYNC) ; port MCLK3_P
RDA3_N: DD25.79(~{RdataA}) ; port RDA3_N
RDA3_P: DD25.78(RdataA) ; port RDA3_P
RDB3_N: DD25.48(~{RdataB}) ; port RDB3_N
RDB3_P: DD25.49(RdataB) ; port RDB3_P
RDC3_N: DD25.97(~{RdataC}) ; port RDC3_N
RDC3_P: DD25.98(RdataC) ; port RDC3_P
RDD3_N: DD25.28(~{RdataD}) ; port RDD3_N
RDD3_P: DD25.27(RdataD) ; port RDD3_P
RSA3_N: DD25.81(~{RstrobeA}) ; port RSA3_N
RSA3_P: DD25.80(RstrobeA) ; port RSA3_P
RSB3_N: DD25.46(~{RstrobeB}) ; port RSB3_N
RSB3_P: DD25.47(RstrobeB) ; port RSB3_P
RSC3_N: DD25.95(~{RstrobeC}) ; port RSC3_N
RSC3_P: DD25.96(RstrobeC) ; port RSC3_P
RSD3_N: DD25.30(~{RstrobeD}) ; port RSD3_N
RSD3_P: DD25.29(RstrobeD) ; port RSD3_P
TDC_CLK_3_N: DD25.20(~{MCLK}) R14.1 ; port TDC_CLK_3_N
TDC_CLK_3_P: DD25.19(MCLK) R14.2 ; port TDC_CLK_3_P
TDCCLK3_N: DD25.44(~{RCLK}) ; port TDCCLK3_N
TDCCLK3_P: DD25.45(RCLK) ; port TDCCLK3_P
THS788_OT_ALARM: DD25.53(OT_ALARM) ; port THS788_OT_ALARM
THS788_RESET: DD25.51(~{RESET}) ; port THS788_RESET

Not connected (* = marked no-connect by the designer): DD25 3(NC)* 4(NC)* 5(NC)* 6(NC)* 9(NC)* 14(NC)* 17(NC)* 18(NC)* 26(NC)* 50(NC)* 52(TEMP)* 54(NC)* 59(NC)* 62(NC)* 67(NC)* 70(NC)* 71(NC)* 72(NC)* 73(NC)* 76(NC)* 100(NC)*

### Layout directives
differential pair: Event_N, Event_P, MCLK3_N, MCLK3_P, RDA3_N, RDA3_P, RDB3_N, RDB3_P, RDC3_N, RDC3_P, RDD3_N, RDD3_P, RSA3_N, RSA3_P, RSB3_N, RSB3_P, RSC3_N, RSC3_P, RSD3_N, RSD3_P, TDC_CLK_3_N, TDC_CLK_3_P, TDCCLK3_N, TDCCLK3_P

### Notes on the sheet
- Project/Equipment
- Document
- Designer
- Drawn by
- Check.by
- Copyright WUT ISE 2024.
  This documentation describes Open Hardware and is licensed under the CERN OHL v.2. You may redistribute and modify this documentation under the terms of the CERN OHL v.2. (http://ohwr.org/CERNOHL). This documentation is distributed WITHOUT ANY EXPRESS OR IMPLIED WARRANTY, INCLUDING OF MERCHANTABILITY, SATISFACTORY QUALITY AND FITNESS FOR A PARTICULAR PURPOSE. Please see the CERN OHL v.2 for applicable conditions.
- Contact
- File
- Last Mod.
- Print Date
- Sheet
- Size
- A3
- of
- Rev

### Library data of the parts
C5 C22 C229 C232-C234 C236-C239 C263 C264 = CC0805_220NF_50V_10%_X7R: as C21 on sheet THS788_1; Part Number: CC0805_220NF_50V_10%_X7R; Component Kind: Standard; Component Type: Standard; Pin Count: 2; Value: 220nF; Status: Preferred; Manufacturer Part Number: CC0805_220NF_50V_10%_X7R; Case: 0805; Mounted: Yes; Socket: No; SMD: Yes; Sense: No; Manufacturer1 Example: MURATA; Manufacturer1 ComponentHeight: 1.35mm; HelpURL: \\cern.ch\dfs\Applications\Altium\Datasheets\CC0805_X7R_MURATA.pdf; Author: CERN DEM JLC; CreateDate: 03.12.2007; LatestRevisionDate: 03.12.2007
DD25 = THS788PFD: as DD4 on sheet THS788_1; Part Number: THS788PFD; Component Kind: Standard; Component Type: Standard; Device: THS788PFD; Footprint: TEXAS_3PFD (S-PQFP-G100); PackageDescription: QFP, 0.50mm Pitch, Square; 100 Pin, 14.0mm L X 14.0mm W X 1.20mm H body (w/Thermal Tab 6.0 X 6.0mm), IPC Medium Density; Status: Not Recommended; Part Description: Quad-Channel Time Measurement Unit (TMU); Manufacturer Part Number: THS788PFD; Pin Count: 101; Case: QFP100; Mounted: Yes; Socket: No; SMD: Yes; Sense: No; ComponentHeight: 1.2mm; Author: CERN DEM HF; HelpURL: \\cern.ch\dfs\Applications\Altium\Datasheets\THS788.pdf; CreateDate: 10.06.2024; LatestRevisionDate: 10.06.2024
R14 = R0603_100R_1%_0.1W_100PPM: as R32 on sheet THS788_1; Part Number: R0603_100R_1%_0.1W_100PPM; Component Kind: Standard; Component Type: Standard; Pin Count: 2; Value: 100; Status: Preferred; Manufacturer Part Number: R0603_100R_1%_0.1W_100PPM; Case: 0603; Mounted: Yes; Sense: No; Socket: No; SMD: Yes; Manufacturer1 Example: NIC COMPONENT; Manufacturer1 ComponentHeight: 0.55mm; HelpURL: \\cern.ch\dfs\Applications\Altium\Datasheets\R0603_3NIC_3NRC.pdf; Author: CERN DEM JLC; CreateDate: 03.12.2007; LatestRevisionDate: 13.03.2008

## Sheet FPGA_A_B.SchDoc: FIT_PM12 board
size 420 x 297 mm; CheckedBy: G.Kasprowicz; Author: INR Moscow; CompanyName: WUT ISE; DrawnBy: M.Podgórski; Organization: WUT ISE; Address1: PW ISE; Address2: Nowowiejska 15/19 00-665 Warsaw; Address3: gkasprow@gmail.com; DocumentNumber: 30; Revision: 2; SheetNumber: 29; SheetTotal: 34; ModifiedBy: -; CheckedDate: -; Title2: FPGA A B ADC; DivGrp: WUT ISE; Designer: INR RAS; ModifiedDate: -; ProjectName: Sensor Box
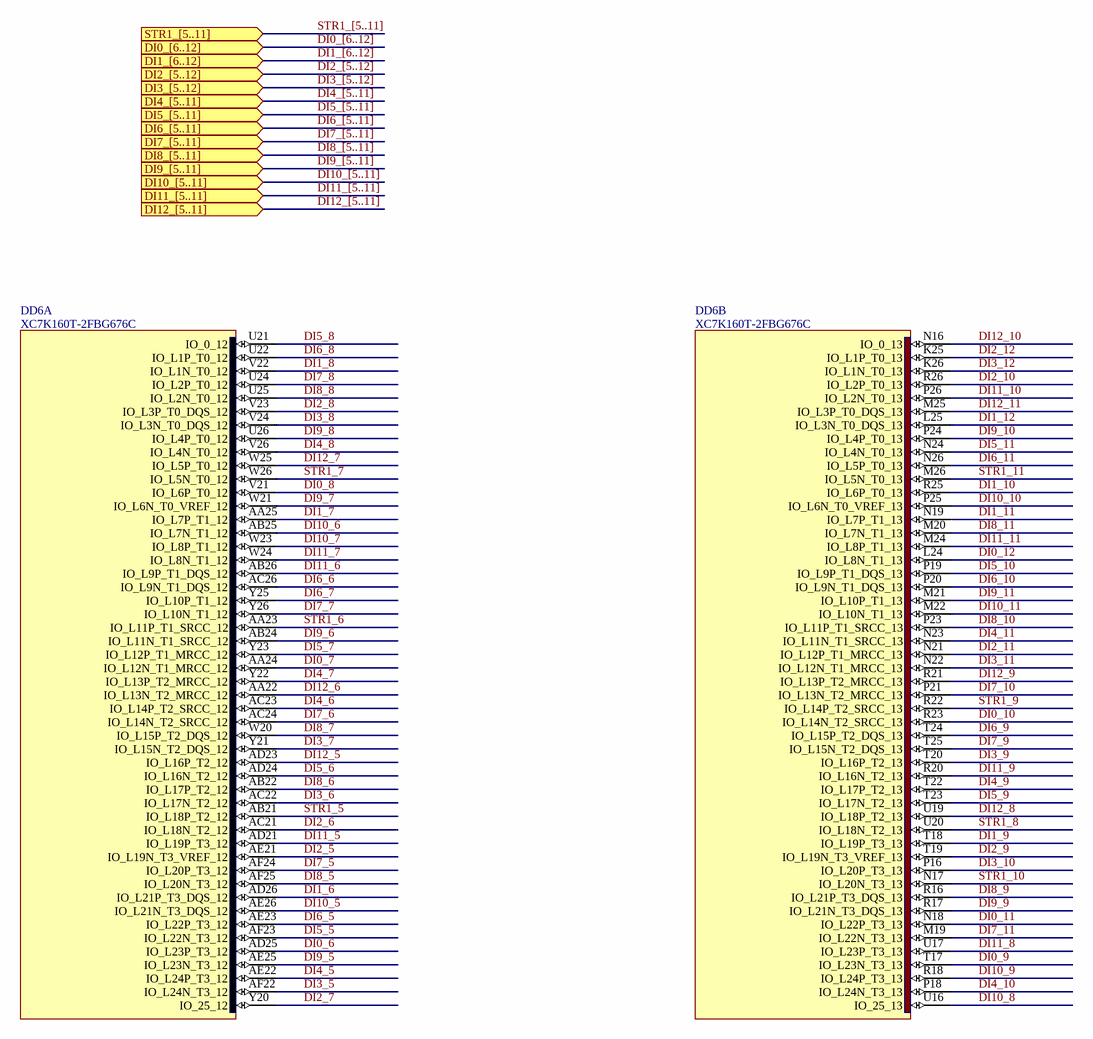
[diagram p19: FPGA_A_B.SchDoc]

### Parts
DD6  XC7K160T-2FBG676C  [BGA676C100P26X26_2700X2700X254]  (parts A,B of 15)

### Ports
DI0_[6..12] (in), DI1_[6..12] (in), DI2_[5..12] (in), DI3_[5..12] (in), DI4_[5..11] (in), DI5_[5..11] (in), DI6_[5..11] (in), DI7_[5..11] (in), DI8_[5..11] (in), DI9_[5..11] (in), DI10_[5..11] (in), DI11_[5..11] (in), DI12_[5..11] (in), STR1_[5..11] (in)

### Nets
DI0_6: DD6.AD25(IO_L23P_T3_12)  [project net DI0_]
DI0_7: DD6.AA24(IO_L12N_T1_MRCC_12)  [project net DI0_]
DI0_8: DD6.V21(IO_L6P_T0_12)  [project net DI0_]
DI0_9: DD6.T17(IO_L23N_T3_13)  [project net DI0_]
DI0_10: DD6.R23(IO_L14N_T2_SRCC_13)  [project net DI0_]
DI0_11: DD6.N18(IO_L22P_T3_13)  [project net DI0_]
DI0_12: DD6.L24(IO_L8N_T1_13)  [project net DI0_]
DI1_6: DD6.AD26(IO_L21P_T3_DQS_12)  [project net DI1_]
DI1_7: DD6.AA25(IO_L7P_T1_12)  [project net DI1_]
DI1_8: DD6.V22(IO_L1N_T0_12)  [project net DI1_]
DI1_9: DD6.T18(IO_L19P_T3_13)  [project net DI1_]
DI1_10: DD6.R25(IO_L6P_T0_13)  [project net DI1_]
DI1_11: DD6.N19(IO_L7P_T1_13)  [project net DI1_]
DI1_12: DD6.L25(IO_L3N_T0_DQS_13)  [project net DI1_]
DI2_5: DD6.AE21(IO_L19N_T3_VREF_12)  [project net DI2_]
DI2_6: DD6.AC21(IO_L18N_T2_12)  [project net DI2_]
DI2_7: DD6.Y20(IO_25_12)  [project net DI2_]
DI2_8: DD6.V23(IO_L3P_T0_DQS_12)  [project net DI2_]
DI2_9: DD6.T19(IO_L19N_T3_VREF_13)  [project net DI2_]
DI2_10: DD6.R26(IO_L2P_T0_13)  [project net DI2_]
DI2_11: DD6.N21(IO_L12P_T1_MRCC_13)  [project net DI2_]
DI2_12: DD6.K25(IO_L1P_T0_13)  [project net DI2_]
DI3_5: DD6.AF22(IO_L24N_T3_12)  [project net DI3_]
DI3_6: DD6.AC22(IO_L17N_T2_12)  [project net DI3_]
DI3_7: DD6.Y21(IO_L15N_T2_DQS_12)  [project net DI3_]
DI3_8: DD6.V24(IO_L3N_T0_DQS_12)  [project net DI3_]
DI3_9: DD6.T20(IO_L16P_T2_13)  [project net DI3_]
DI3_10: DD6.P16(IO_L20P_T3_13)  [project net DI3_]
DI3_11: DD6.N22(IO_L12N_T1_MRCC_13)  [project net DI3_]
DI3_12: DD6.K26(IO_L1N_T0_13)  [project net DI3_]
DI4_5: DD6.AE22(IO_L24P_T3_12)  [project net DI4_]
DI4_6: DD6.AC23(IO_L14P_T2_SRCC_12)  [project net DI4_]
DI4_7: DD6.Y22(IO_L13P_T2_MRCC_12)  [project net DI4_]
DI4_8: DD6.V26(IO_L4N_T0_12)  [project net DI4_]
DI4_9: DD6.T22(IO_L17P_T2_13)  [project net DI4_]
DI4_10: DD6.P18(IO_L24N_T3_13)  [project net DI4_]
DI4_11: DD6.N23(IO_L11N_T1_SRCC_13)  [project net DI4_]
DI5_5: DD6.AF23(IO_L22N_T3_12)  [project net DI5_]
DI5_6: DD6.AD24(IO_L16N_T2_12)  [project net DI5_]
DI5_7: DD6.Y23(IO_L12P_T1_MRCC_12)  [project net DI5_]
DI5_8: DD6.U21(IO_0_12)  [project net DI5_]
DI5_9: DD6.T23(IO_L17N_T2_13)  [project net DI5_]
DI5_10: DD6.P19(IO_L9P_T1_DQS_13)  [project net DI5_]
DI5_11: DD6.N24(IO_L4N_T0_13)  [project net DI5_]
DI6_5: DD6.AE23(IO_L22P_T3_12)  [project net DI6_]
DI6_6: DD6.AC26(IO_L9N_T1_DQS_12)  [project net DI6_]
DI6_7: DD6.Y25(IO_L10P_T1_12)  [project net DI6_]
DI6_8: DD6.U22(IO_L1P_T0_12)  [project net DI6_]
DI6_9: DD6.T24(IO_L15P_T2_DQS_13)  [project net DI6_]
DI6_10: DD6.P20(IO_L9N_T1_DQS_13)  [project net DI6_]
DI6_11: DD6.N26(IO_L5P_T0_13)  [project net DI6_]
DI7_5: DD6.AF24(IO_L20P_T3_12)  [project net DI7_]
DI7_6: DD6.AC24(IO_L14N_T2_SRCC_12)  [project net DI7_]
DI7_7: DD6.Y26(IO_L10N_T1_12)  [project net DI7_]
DI7_8: DD6.U24(IO_L2P_T0_12)  [project net DI7_]
DI7_9: DD6.T25(IO_L15N_T2_DQS_13)  [project net DI7_]
DI7_10: DD6.P21(IO_L13N_T2_MRCC_13)  [project net DI7_]
DI7_11: DD6.M19(IO_L22N_T3_13)  [project net DI7_]
DI8_5: DD6.AF25(IO_L20N_T3_12)  [project net DI8_]
DI8_6: DD6.AB22(IO_L17P_T2_12)  [project net DI8_]
DI8_7: DD6.W20(IO_L15P_T2_DQS_12)  [project net DI8_]
DI8_8: DD6.U25(IO_L2N_T0_12)  [project net DI8_]
DI8_9: DD6.R16(IO_L21P_T3_DQS_13)  [project net DI8_]
DI8_10: DD6.P23(IO_L11P_T1_SRCC_13)  [project net DI8_]
DI8_11: DD6.M20(IO_L7N_T1_13)  [project net DI8_]
DI9_5: DD6.AE25(IO_L23N_T3_12)  [project net DI9_]
DI9_6: DD6.AB24(IO_L11N_T1_SRCC_12)  [project net DI9_]
DI9_7: DD6.W21(IO_L6N_T0_VREF_12)  [project net DI9_]
DI9_8: DD6.U26(IO_L4P_T0_12)  [project net DI9_]
DI9_9: DD6.R17(IO_L21N_T3_DQS_13)  [project net DI9_]
DI9_10: DD6.P24(IO_L4P_T0_13)  [project net DI9_]
DI9_11: DD6.M21(IO_L10P_T1_13)  [project net DI9_]
DI10_5: DD6.AE26(IO_L21N_T3_DQS_12)  [project net DI10_]
DI10_6: DD6.AB25(IO_L7N_T1_12)  [project net DI10_]
DI10_7: DD6.W23(IO_L8P_T1_12)  [project net DI10_]
DI10_8: DD6.U16(IO_25_13)  [project net DI10_]
DI10_9: DD6.R18(IO_L24P_T3_13)  [project net DI10_]
DI10_10: DD6.P25(IO_L6N_T0_VREF_13)  [project net DI10_]
DI10_11: DD6.M22(IO_L10N_T1_13)  [project net DI10_]
DI11_5: DD6.AD21(IO_L19P_T3_12)  [project net DI11_]
DI11_6: DD6.AB26(IO_L9P_T1_DQS_12)  [project net DI11_]
DI11_7: DD6.W24(IO_L8N_T1_12)  [project net DI11_]
DI11_8: DD6.U17(IO_L23P_T3_13)  [project net DI11_]
DI11_9: DD6.R20(IO_L16N_T2_13)  [project net DI11_]
DI11_10: DD6.P26(IO_L2N_T0_13)  [project net DI11_]
DI11_11: DD6.M24(IO_L8P_T1_13)  [project net DI11_]
DI12_5: DD6.AD23(IO_L16P_T2_12)  [project net DI12_]
DI12_6: DD6.AA22(IO_L13N_T2_MRCC_12)  [project net DI12_]
DI12_7: DD6.W25(IO_L5P_T0_12)  [project net DI12_]
DI12_8: DD6.U19(IO_L18P_T2_13)  [project net DI12_]
DI12_9: DD6.R21(IO_L13P_T2_MRCC_13)  [project net DI12_]
DI12_10: DD6.N16(IO_0_13)  [project net DI12_]
DI12_11: DD6.M25(IO_L3P_T0_DQS_13)  [project net DI12_]
STR1_5: DD6.AB21(IO_L18P_T2_12)  [project net STR1_]
STR1_6: DD6.AA23(IO_L11P_T1_SRCC_12)  [project net STR1_]
STR1_7: DD6.W26(IO_L5N_T0_12)  [project net STR1_]
STR1_8: DD6.U20(IO_L18N_T2_13)  [project net STR1_]
STR1_9: DD6.R22(IO_L14P_T2_SRCC_13)  [project net STR1_]
STR1_10: DD6.N17(IO_L20N_T3_13)  [project net STR1_]
STR1_11: DD6.M26(IO_L5N_T0_13)  [project net STR1_]

### Buses and harness runs
bus DI0_[6..12] = port DI0_[6..12]
bus DI1_[6..12] = port DI1_[6..12]
bus DI2_[5..12] = port DI2_[5..12]
bus DI3_[5..12] = port DI3_[5..12]
bus DI4_[5..11] = port DI4_[5..11]
bus DI5_[5..11] = port DI5_[5..11]
bus DI6_[5..11] = port DI6_[5..11]
bus DI7_[5..11] = port DI7_[5..11]
bus DI8_[5..11] = port DI8_[5..11]
bus DI9_[5..11] = port DI9_[5..11]
bus DI10_[5..11] = port DI10_[5..11]
bus DI11_[5..11] = port DI11_[5..11]
bus DI12_[5..11] = port DI12_[5..11]
bus STR1_[5..11] = port STR1_[5..11]

### Notes on the sheet
- Project/Equipment
- Document
- Designer
- Drawn by
- Check.by
- Copyright WUT ISE 2024.
  This documentation describes Open Hardware and is licensed under the CERN OHL v.2. You may redistribute and modify this documentation under the terms of the CERN OHL v.2. (http://ohwr.org/CERNOHL). This documentation is distributed WITHOUT ANY EXPRESS OR IMPLIED WARRANTY, INCLUDING OF MERCHANTABILITY, SATISFACTORY QUALITY AND FITNESS FOR A PARTICULAR PURPOSE. Please see the CERN OHL v.2 for applicable conditions.
- Contact
- File
- Last Mod.
- Print Date
- Sheet
- Size
- A3
- of
- Rev

### Library data of the parts
DD6 = XC7K160T-2FBG676C: as DD6 on sheet FPGA_H; Part Number: XC7K160T-2FBG676C; Component Kind: Standard; Component Type: Standard; Device: XC7K160T-2FBG676C; PackageDescription: BGA, 1.00mm Pitch, Square; 676 Pin, 26 Columns X 26 Rows, Body 27.0mm X 27.0mm X 2.54mm H, IPC Medium Density; Manufacturer Part Number: XC7K160T-2FBG676C; Pin Count: 676; Case: BGA676; Mounted: Yes; Socket: No; SMD: Yes; Sense: No; ComponentHeight: 2.54mm; HelpURL: \\cern.ch\dfs\Applications\Altium\Datasheets\XC7K160T-xFBG676C.pdf; ComponentLink1URL: \\cern.ch\dfs\Applications\Altium\Datasheets\XC7K160T-xFBG676C_Package-Pinout.pdf; ComponentLink1Description: Package/Pinout; Author: CERN DEM BC; CreateDate: 06.02.2020; LatestRevisionDate: 06.02.2020

## Sheet FPGA_G.SchDoc: FIT_PM12 board
size 420 x 297 mm; CheckedBy: G.Kasprowicz; Author: INR Moscow; CompanyName: WUT ISE; DrawnBy: M.Podgórski; Organization: WUT ISE; Address1: PW ISE; Address2: Nowowiejska 15/19 00-665 Warsaw; Address3: gkasprow@gmail.com; DocumentNumber: 33; Revision: 2; SheetNumber: 33; SheetTotal: 34; ModifiedBy: -; CheckedDate: -; Title2: FPGA G TDC2; DivGrp: WUT ISE; Designer: INR RAS; ModifiedDate: -; ProjectName: Sensor Box
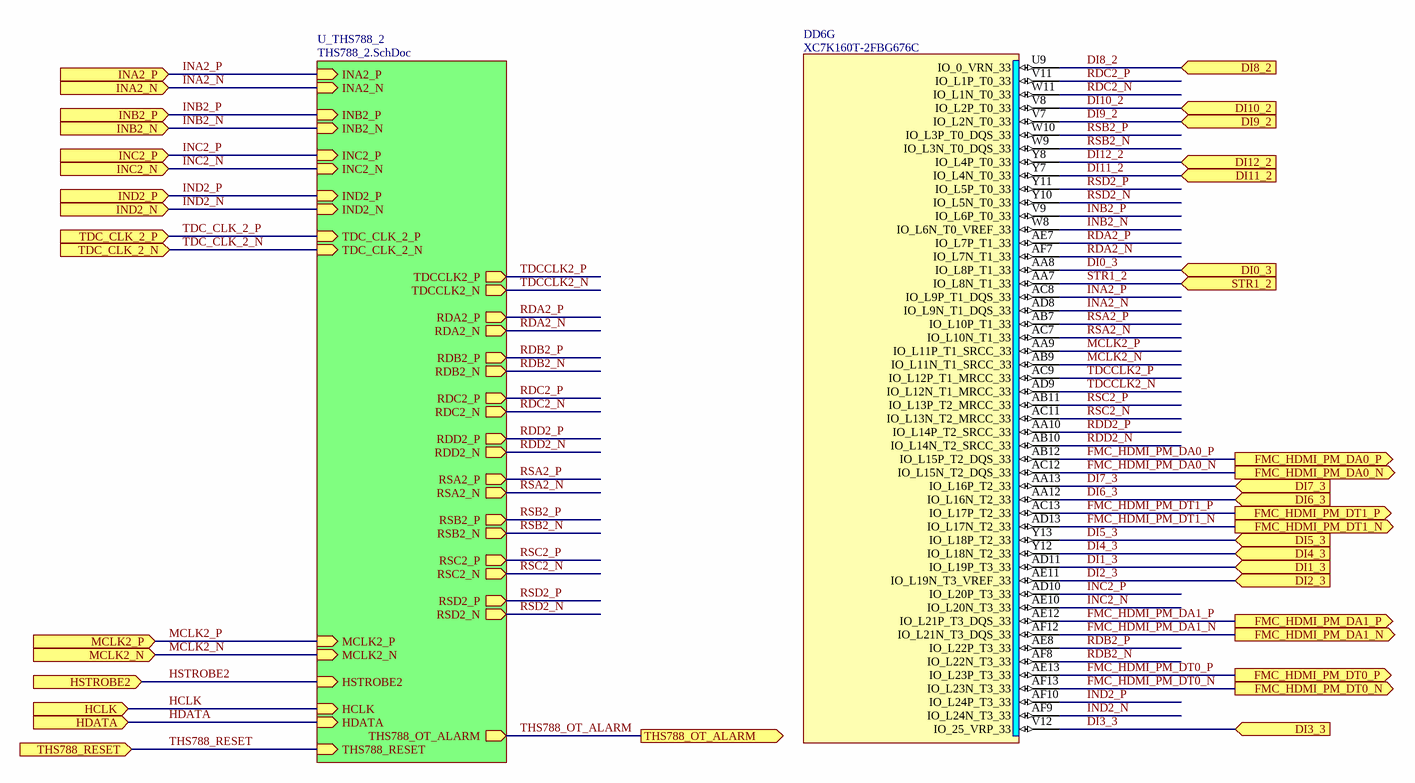
[diagram p20: FPGA_G.SchDoc]

### Parts
DD6  XC7K160T-2FBG676C  [BGA676C100P26X26_2700X2700X254]  (part G of 15)

### Sub-sheets
U_THS788_2 = THS788_2.SchDoc: INC2_P (in), INC2_N (in), IND2_N (in), IND2_P (in), RDD2_P (out), RDD2_N (out), RSD2_P (out), RSD2_N (out), HDATA (in), HCLK (in), HSTROBE2 (in), TDCCLK2_P (out), TDCCLK2_N (out), RSB2_P (out), RSB2_N (out), RDB2_P (out), RDB2_N (out), THS788_OT_ALARM (out), THS788_RESET (in), MCLK2_N (in), MCLK2_P (in), INB2_N (in), INB2_P (in), TDC_CLK_2_P (in), TDC_CLK_2_N (in), INA2_P (in), INA2_N (in), RDA2_N (out), RDA2_P (out), RSA2_P (out), RSA2_N (out), RSC2_N (out), RSC2_P (out), RDC2_N (out), RDC2_P (out)

### Ports
DI0_3 (in), DI1_3 (in), DI2_3 (in), DI3_3 (in), DI4_3 (in), DI5_3 (in), DI6_3 (in), DI7_3 (in), DI8_2 (in), DI9_2 (in), DI10_2 (in), DI11_2 (in), DI12_2 (in), FMC_HDMI_PM_DA0_N (out), FMC_HDMI_PM_DA0_P (out), FMC_HDMI_PM_DA1_N (out), FMC_HDMI_PM_DA1_P (out), FMC_HDMI_PM_DT0_N (out), FMC_HDMI_PM_DT0_P (out), FMC_HDMI_PM_DT1_N (out), FMC_HDMI_PM_DT1_P (out), HCLK (in), HDATA (in), HSTROBE2 (in), INA2_N (in), INA2_P (in), INB2_N (in), INB2_P (in), INC2_N (in), INC2_P (in), IND2_N (in), IND2_P (in), MCLK2_N (in), MCLK2_P (in), STR1_2 (in), TDC_CLK_2_N (in), TDC_CLK_2_P (in), THS788_OT_ALARM (out), THS788_RESET (in)

### Nets
DI0_3: DD6.AA8(IO_L8P_T1_33) ; port DI0_3  [project net DI0_]
DI1_3: DD6.AD11(IO_L19P_T3_33) ; port DI1_3  [project net DI1_]
DI2_3: DD6.AE11(IO_L19N_T3_VREF_33) ; port DI2_3  [project net DI2_]
DI3_3: DD6.V12(IO_25_VRP_33) ; port DI3_3  [project net DI3_]
DI4_3: DD6.Y12(IO_L18N_T2_33) ; port DI4_3  [project net DI4_]
DI5_3: DD6.Y13(IO_L18P_T2_33) ; port DI5_3  [project net DI5_]
DI6_3: DD6.AA12(IO_L16N_T2_33) ; port DI6_3  [project net DI6_]
DI7_3: DD6.AA13(IO_L16P_T2_33) ; port DI7_3  [project net DI7_]
DI8_2: DD6.U9(IO_0_VRN_33) ; port DI8_2  [project net DI8_]
DI9_2: DD6.V7(IO_L2N_T0_33) ; port DI9_2  [project net DI9_]
DI10_2: DD6.V8(IO_L2P_T0_33) ; port DI10_2  [project net DI10_]
DI11_2: DD6.Y7(IO_L4N_T0_33) ; port DI11_2  [project net DI11_]
DI12_2: DD6.Y8(IO_L4P_T0_33) ; port DI12_2  [project net DI12_]
FMC_HDMI_PM_DA0_N: DD6.AC12(IO_L15N_T2_DQS_33) ; port FMC_HDMI_PM_DA0_N
FMC_HDMI_PM_DA0_P: DD6.AB12(IO_L15P_T2_DQS_33) ; port FMC_HDMI_PM_DA0_P
FMC_HDMI_PM_DA1_N: DD6.AF12(IO_L21N_T3_DQS_33) ; port FMC_HDMI_PM_DA1_N
FMC_HDMI_PM_DA1_P: DD6.AE12(IO_L21P_T3_DQS_33) ; port FMC_HDMI_PM_DA1_P
FMC_HDMI_PM_DT0_N: DD6.AF13(IO_L23N_T3_33) ; port FMC_HDMI_PM_DT0_N
FMC_HDMI_PM_DT0_P: DD6.AE13(IO_L23P_T3_33) ; port FMC_HDMI_PM_DT0_P
FMC_HDMI_PM_DT1_N: DD6.AD13(IO_L17N_T2_33) ; port FMC_HDMI_PM_DT1_N
FMC_HDMI_PM_DT1_P: DD6.AC13(IO_L17P_T2_33) ; port FMC_HDMI_PM_DT1_P
HCLK: port HCLK, sheet U_THS788_2/HCLK
HDATA: port HDATA, sheet U_THS788_2/HDATA
HSTROBE2: port HSTROBE2, sheet U_THS788_2/HSTROBE2
INA2_N: DD6.AD8(IO_L9N_T1_DQS_33) ; port INA2_N, sheet U_THS788_2/INA2_N  [project net Event_N]
INA2_P: DD6.AC8(IO_L9P_T1_DQS_33) ; port INA2_P, sheet U_THS788_2/INA2_P  [project net Event_P]
INB2_N: DD6.W8(IO_L6N_T0_VREF_33) ; port INB2_N, sheet U_THS788_2/INB2_N  [project net Event_N]
INB2_P: DD6.V9(IO_L6P_T0_33) ; port INB2_P, sheet U_THS788_2/INB2_P  [project net Event_P]
INC2_N: DD6.AE10(IO_L20N_T3_33) ; port INC2_N, sheet U_THS788_2/INC2_N  [project net Event_N]
INC2_P: DD6.AD10(IO_L20P_T3_33) ; port INC2_P, sheet U_THS788_2/INC2_P  [project net Event_P]
IND2_N: DD6.AF9(IO_L24N_T3_33) ; port IND2_N, sheet U_THS788_2/IND2_N  [project net Event_N]
IND2_P: DD6.AF10(IO_L24P_T3_33) ; port IND2_P, sheet U_THS788_2/IND2_P  [project net Event_P]
MCLK2_N: DD6.AB9(IO_L11N_T1_SRCC_33) ; port MCLK2_N, sheet U_THS788_2/MCLK2_N
MCLK2_P: DD6.AA9(IO_L11P_T1_SRCC_33) ; port MCLK2_P, sheet U_THS788_2/MCLK2_P
RDA2_N: DD6.AF7(IO_L7N_T1_33) ; sheet U_THS788_2/RDA2_N
RDA2_P: DD6.AE7(IO_L7P_T1_33) ; sheet U_THS788_2/RDA2_P
RDB2_N: DD6.AF8(IO_L22N_T3_33) ; sheet U_THS788_2/RDB2_N
RDB2_P: DD6.AE8(IO_L22P_T3_33) ; sheet U_THS788_2/RDB2_P
RDC2_N: DD6.W11(IO_L1N_T0_33) ; sheet U_THS788_2/RDC2_N
RDC2_P: DD6.V11(IO_L1P_T0_33) ; sheet U_THS788_2/RDC2_P
RDD2_N: DD6.AB10(IO_L14N_T2_SRCC_33) ; sheet U_THS788_2/RDD2_N
RDD2_P: DD6.AA10(IO_L14P_T2_SRCC_33) ; sheet U_THS788_2/RDD2_P
RSA2_N: DD6.AC7(IO_L10N_T1_33) ; sheet U_THS788_2/RSA2_N
RSA2_P: DD6.AB7(IO_L10P_T1_33) ; sheet U_THS788_2/RSA2_P
RSB2_N: DD6.W9(IO_L3N_T0_DQS_33) ; sheet U_THS788_2/RSB2_N
RSB2_P: DD6.W10(IO_L3P_T0_DQS_33) ; sheet U_THS788_2/RSB2_P
RSC2_N: DD6.AC11(IO_L13N_T2_MRCC_33) ; sheet U_THS788_2/RSC2_N
RSC2_P: DD6.AB11(IO_L13P_T2_MRCC_33) ; sheet U_THS788_2/RSC2_P
RSD2_N: DD6.Y10(IO_L5N_T0_33) ; sheet U_THS788_2/RSD2_N
RSD2_P: DD6.Y11(IO_L5P_T0_33) ; sheet U_THS788_2/RSD2_P
STR1_2: DD6.AA7(IO_L8N_T1_33) ; port STR1_2  [project net STR1_]
TDC_CLK_2_N: port TDC_CLK_2_N, sheet U_THS788_2/TDC_CLK_2_N
TDC_CLK_2_P: port TDC_CLK_2_P, sheet U_THS788_2/TDC_CLK_2_P
TDCCLK2_N: DD6.AD9(IO_L12N_T1_MRCC_33) ; sheet U_THS788_2/TDCCLK2_N
TDCCLK2_P: DD6.AC9(IO_L12P_T1_MRCC_33) ; sheet U_THS788_2/TDCCLK2_P
THS788_OT_ALARM: port THS788_OT_ALARM, sheet U_THS788_2/THS788_OT_ALARM
THS788_RESET: port THS788_RESET, sheet U_THS788_2/THS788_RESET

### Notes on the sheet
- Project/Equipment
- Document
- Designer
- Drawn by
- Check.by
- Copyright WUT ISE 2024.
  This documentation describes Open Hardware and is licensed under the CERN OHL v.2. You may redistribute and modify this documentation under the terms of the CERN OHL v.2. (http://ohwr.org/CERNOHL). This documentation is distributed WITHOUT ANY EXPRESS OR IMPLIED WARRANTY, INCLUDING OF MERCHANTABILITY, SATISFACTORY QUALITY AND FITNESS FOR A PARTICULAR PURPOSE. Please see the CERN OHL v.2 for applicable conditions.
- Contact
- File
- Last Mod.
- Print Date
- Sheet
- Size
- A3
- of
- Rev

### Library data of the parts
DD6 = XC7K160T-2FBG676C: as DD6 on sheet FPGA_H; Part Number: XC7K160T-2FBG676C; Component Kind: Standard; Component Type: Standard; Device: XC7K160T-2FBG676C; PackageDescription: BGA, 1.00mm Pitch, Square; 676 Pin, 26 Columns X 26 Rows, Body 27.0mm X 27.0mm X 2.54mm H, IPC Medium Density; Manufacturer Part Number: XC7K160T-2FBG676C; Pin Count: 676; Case: BGA676; Mounted: Yes; Socket: No; SMD: Yes; Sense: No; ComponentHeight: 2.54mm; HelpURL: \\cern.ch\dfs\Applications\Altium\Datasheets\XC7K160T-xFBG676C.pdf; ComponentLink1URL: \\cern.ch\dfs\Applications\Altium\Datasheets\XC7K160T-xFBG676C_Package-Pinout.pdf; ComponentLink1Description: Package/Pinout; Author: CERN DEM BC; CreateDate: 06.02.2020; LatestRevisionDate: 06.02.2020